# Altium schematic sheet top.SchDoc
size A
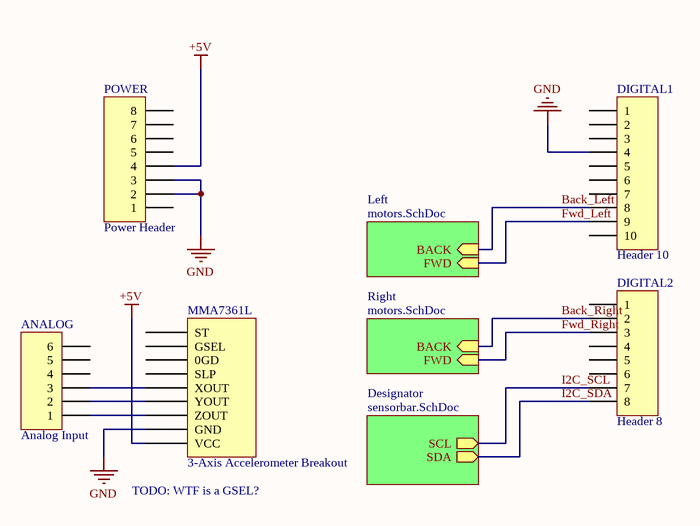
[diagram p0: top.SchDoc]

## Parts
ANALOG  Analog Input  [HDR1X6]
DIGITAL1  Header 10  [HDR1X10]
DIGITAL2  Header 8  [HDR1X8]
MMA7361L  3-Axis Accelerometer Breakout
POWER  Power Header  [HDR1X8]

## Sub-sheets
Designator = sensorbar.SchDoc: SDA (out), SCL (out)
Left = motors.SchDoc: FWD (in), BACK (in)
Right = motors.SchDoc: FWD (in), BACK (in)

## Nets
+5V: MMA7361L.VCC POWER.4
GND: DIGITAL1.4 MMA7361L.GND POWER.2 POWER.3
Back_Left: DIGITAL1.8 ; sheet Left/BACK
Back_Right: DIGITAL2.2 ; sheet Right/BACK
Fwd_Left: DIGITAL1.9 ; sheet Left/FWD
Fwd_Right: DIGITAL2.3 ; sheet Right/FWD
I2C_SCL: DIGITAL2.7 ; sheet Designator/SCL
I2C_SDA: DIGITAL2.8 ; sheet Designator/SDA
NetANALOG_1: ANALOG.1 MMA7361L.ZOUT
NetANALOG_2: ANALOG.2 MMA7361L.YOUT
NetANALOG_3: ANALOG.3 MMA7361L.XOUT

Not connected (* = marked no-connect by the designer): ANALOG 4 5 6; DIGITAL1 1 2 3 5 6 7 10; DIGITAL2 1 4 5 6; MMA7361L 0GD GSEL SLP ST; POWER 1 5 6 7 8

## Notes on the sheet
- (near MMA7361L) TODO: WTF is a GSEL?

## Library data of the parts
ANALOG = Header 6: Header, 6-Pin; LatestRevisionDate: 17-Jul-2002; LatestRevisionNote: Re-released for DXP Platform.; Publisher: Altium Limited
DIGITAL1 = Header 10: Header, 10-Pin; LatestRevisionDate: 17-Jul-2002; LatestRevisionNote: Re-released for DXP Platform.; Publisher: Altium Limited
DIGITAL2 POWER = Header 8: Header, 8-Pin; LatestRevisionDate: 17-Jul-2002; LatestRevisionNote: Re-released for DXP Platform.; Publisher: Altium Limited
MMA7361L = MMA7361L: ComponentURL: https://www.sparkfun.com/products/9652